# EAGLE design Bikota (EAGLE 9.5.2)
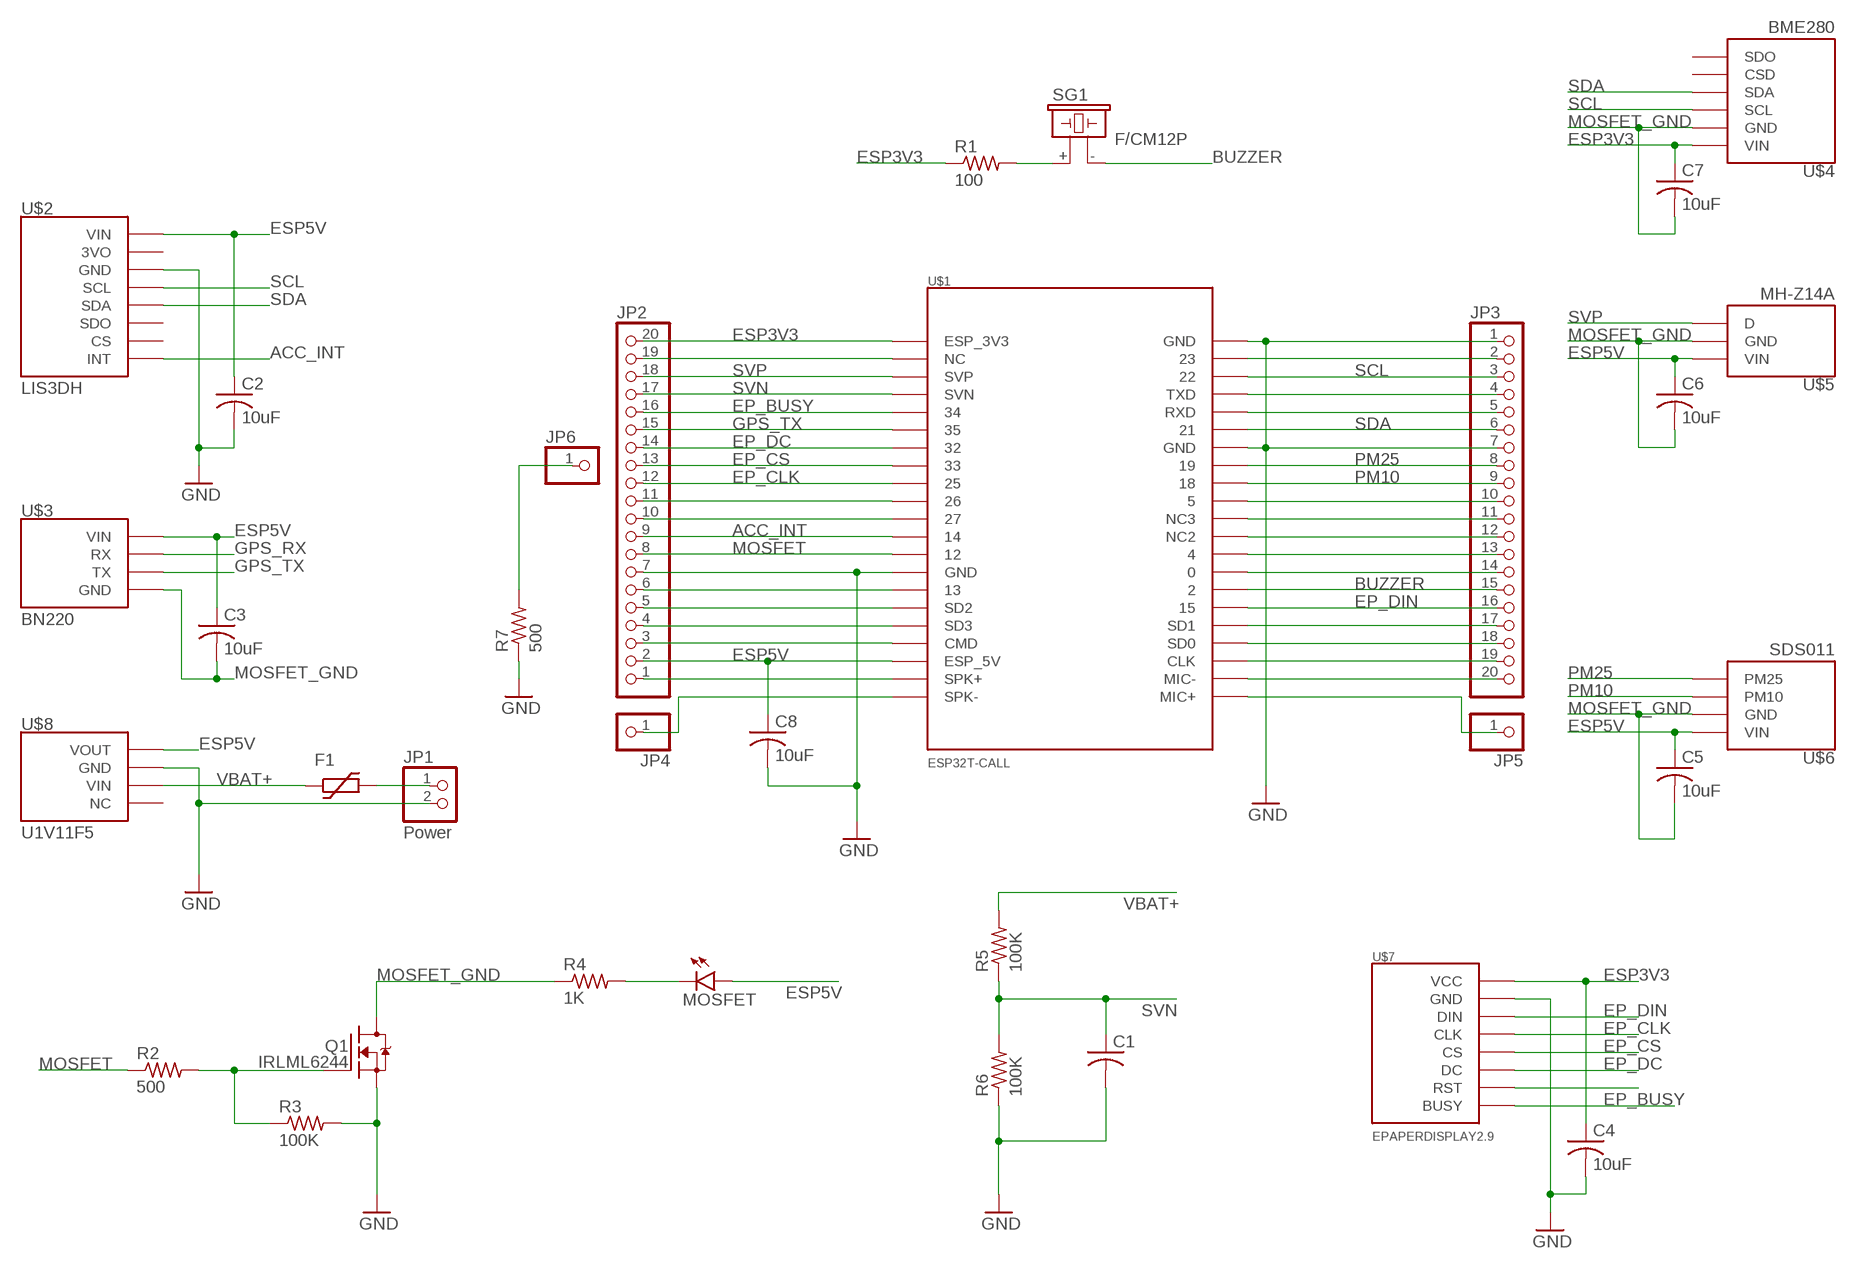
[diagram p0: schematic, sheet 1]

## Parts
C1  C-USC0805  [C0805]
C2  10uF  C-USC0805  [C0805]
C3  10uF  C-USC0805  [C0805]
C4  10uF  C-USC0805  [C0805]
C5  10uF  C-USC0805  [C0805]
C6  10uF  C-USC0805  [C0805]
C7  10uF  C-USC0805  [C0805]
C8  10uF  C-USC0805  [C0805]
F1  1206L  [1206L]
JP1  Power  PINHD-1X2  [1X02]
JP2  PINHD-1X20  [1X20]
JP3  PINHD-1X20  [1X20]
JP4  PINHD-1X1  [1X01]
JP5  PINHD-1X1  [1X01]
JP6  PINHD-1X1  [1X01]
MOSFET  LEDCHIPLED_0805  [CHIPLED_0805]
Q1  IRLML6244  [SOT23]
R1  100  R-US_R0805  [R0805]
R2  500  R-US_R0805  [R0805]
R3  100K  R-US_R0805  [R0805]
R4  1K  R-US_R0805  [R0805]
R5  100K  R-US_R0805  [R0805]
R6  100K  R-US_R0805  [R0805]
R7  500  R-US_R0805  [R0805]
SG1  F/CM12P  [F/CM12P]
U$1  ESP32T-CALL  [ESP32T-CALL]
U$2  LIS3DH  [LIS3DH]
U$3  BN220  [BN220]
U$4  BME280  [BME280]
U$5  MH-Z14A  [MH-Z14A]
U$6  SDS011  [SDS011]
U$7  EPAPERDISPLAY2.9  [EPAPERDISPLAY2.9]
U$8  U1V11F5  [U1V11F5]

## Nets
ACC_INT: JP2.9 U$1.GPIO14 U$2.P$8(INT)
BUZZER: JP3.15 SG1.- U$1.GPIO2
EP_BUSY: JP2.16 U$1.GPIO34 U$7.P$8(BUSY)
EP_CLK: JP2.12 U$1.GPIO25 U$7.P$4(CLK)
EP_CS: JP2.13 U$1.GPIO33 U$7.P$5(CS)
EP_DC: JP2.14 U$1.GPIO32 U$7.P$6(DC)
EP_DIN: JP3.16 U$1.GPIO15 U$7.P$3(DIN)
ESP3V3: C4.1 C7.1 JP2.20 R1.1 U$1.ESP32_3V3(ESP_3V3) U$4.P$1(VIN) U$7.P$1(VCC)
ESP5V: C2.1 C3.1 C5.1 C6.1 C8.1 JP2.2 MOSFET.A U$1.ESP32_5V(ESP_5V) U$2.P$1(VIN) U$3.P$1(VIN) U$5.P$1(VIN) U$6.P$1(VIN) U$8.P$1(VOUT)
GND: C1.2 C2.2 C4.2 C8.2 JP1.2 JP2.7 JP3.1 JP3.7 Q1.2(S) R3.2 R6.1 R7.1 U$1.GND U$1.GND2(GND) U$1.GND3(GND) U$2.P$3(GND) U$7.P$2(GND) U$8.P$2(GND)
GPS_RX: U$3.P$2(RX)
GPS_TX: JP2.15 U$1.GPIO35 U$3.P$3(TX)
MOSFET: JP2.8 R2.1 U$1.GPIO12
MOSFET_GND: C3.2 C5.2 C6.2 C7.2 Q1.3(D) R4.1 U$3.P$4(GND) U$4.P$2(GND) U$5.P$2(GND) U$6.P$2(GND)
N$2: R1.2 SG1.+
N$3: JP2.19 U$1.P$2(NC)
N$4: Q1.1(G) R2.2 R3.1
N$6: MOSFET.C R4.2
N$9: JP2.11 U$1.GPIO26
N$10: JP2.10 U$1.GPIO27
N$11: JP2.6 U$1.GPIO13
N$12: JP2.5 U$1.SD2
N$13: JP2.4 U$1.SD3
N$14: JP2.3 U$1.CMD
N$15: JP2.1 U$1.SPK+
N$16: JP4.1 U$1.SPK-
N$17: JP6.1 R7.2
N$18: JP3.2 U$1.GPIO23
N$20: JP3.4 U$1.TXD
N$21: JP3.5 U$1.RXD
N$23: JP3.10 U$1.GPIO5
N$24: JP3.11 U$1.NC3
N$25: JP3.12 U$1.NC2
N$26: JP3.13 U$1.GPIO4
N$27: JP3.14 U$1.GPIO0
N$29: JP3.17 U$1.SD1
N$30: JP3.18 U$1.SD0
N$31: JP3.19 U$1.CLK
N$32: JP3.20 U$1.MIC-
N$33: JP5.1 U$1.MIC+
N$41: F1.P$2 JP1.1
N$418: U$7.P$7(RST)
PM10: JP3.9 U$1.GPIO18 U$6.P$3(PM10)
PM25: JP3.8 U$1.GPIO19 U$6.P$4(PM25)
SCL: JP3.3 U$1.GPIO22 U$2.P$4(SCL) U$4.P$3(SCL)
SDA: JP3.6 U$1.GPIO21 U$2.P$5(SDA) U$4.P$4(SDA)
SVN: C1.1 JP2.17 R5.1 R6.2 U$1.SVN
SVP: JP2.18 U$1.SVP U$5.P$3(D)
VBAT+: F1.P$1 R5.2 U$8.P$3(VIN)
Unconnected: U$2.P$6(SDO) U$2.P$7(CS) U$4.P$5(CSD) U$4.P$6(SDO) U$8.P$4(NC)

## Power pins joined to a net without a drawn wire
3VO: U$2.P$2(3VO)

## Library data of the parts
C1-C8 = rcl:C-US: CAPACITOR, American symbol; SPICEPREFIX: C
F1 = ptc-littlefuse:1206L
JP1 = pinhead:PINHD-1X2: PIN HEADER
JP2 JP3 = pinhead:PINHD-1X20: PIN HEADER
JP4-JP6 = pinhead:PINHD-1X1: PIN HEADER
MOSFET = led:LED: LED OSRAM: - CHIPLED LG R971, LG N971, LY N971, LG Q971, LY Q971, LO R971, LY R971 LH N974, LH R974 LS Q976, LO Q976, LY Q976 LO Q996 - Hyper CHIPLED LW Q18S LB Q993, LB Q99A, LB R99A - SideLED LS A670, LO A670, LY A670, LG A670, LP A670 LB A673, LV A673, LT A673, LW A673 LH A674 LY A675 LS A676, LA A676, LO A676, LY A676, LW A676 LS A679, LY A679, LG A679 - Hyper Micro SIDELED® LS Y876, LA Y876, LO Y876, LY Y876 LT Y87S - SmartLED LW L88C, LW L88S LB L89C, LB L89S, LG L890 LS L89K, LO L89K, LY L89K LS L896, LA L896, LO L896, LY L896 - TOPLED LS T670, LO T670, LY T670, LG T670, LP T670 LSG T670, LSP T670, LSY T670, LOP T670, LYG T670 LG T671, LOG T671, LSG T671 LB T673, LV T673, LT T673, LW T673 LH T674 LS T676, LA T676, LO T676, LY T676, LB T676, LH T676, LSB T676, LW T676 LB T67C, LV T67C, LT T67C, LS T67K, LO T67K, LY T67K, LW E67C LS E67B, LA E67B, LO E67B, LY E67B, LB E67C, LV E67C, LT E67C LW T67C LS T679, LY T679, LG T679 LS T770, LO T770, LY T770, LG T770, LP T770 LB T773, LV T773, LT T773, LW T773 LH T774 LS E675, LA E675, LY E675, LS T675 LS T776, LA T776, LO T776, LY T776, LB T776 LHGB T686 LT T68C, LB T68C - Hyper Mini TOPLED® LB M676 - Mini TOPLED Santana® LG M470 LS M47K, LO M47K, LY M47K Source: http://www.osram.convergy.de LUXEON: - LUMILED® LXK2-PW12-R00, LXK2-PW12-S00, LXK2-PW14-U00, LXK2-PW14-V00 LXK2-PM12-R00, LXK2-PM12-S00, LXK2-PM14-U00 LXK2-PE12-Q00, LXK2-PE12-R00, LXK2-PE12-S00, LXK2-PE14-T00, LXK2-PE14-U00 LXK2-PB12-K00, LXK2-PB12-L00, LXK2-PB12-M00, LXK2-PB14-N00, LXK2-PB14-P00, LXK2-PB14-Q00 LXK2-PR12-L00, LXK2-PR12-M00, LXK2-PR14-Q00, LXK2-PR14-R00 LXK2-PD12-Q00, LXK2-PD12-R00, LXK2-PD12-S00 LXK2-PH12-R00, LXK2-PH12-S00 LXK2-PL12-P00, LXK2-PL12-Q00, LXK2-PL12-R00 Source: www.luxeon.com KINGBRIGHT: KA-3528ASYC Source: www.kingbright.com
Q1 = bytewerk:IRLML6244: n-channel FET Vds=20V Vgs=+-12V Icont=6A; MF: Internat. Rectifier; MPN: IRLML6244TRPbF; OC_FARNELL: 1864517RL
R1-R7 = rcl:R-US_: RESISTOR, American symbol; SPICEPREFIX: R
SG1 = buzzer:F/CM12P: BUZZER Source: Buerklin; OC_FARNELL: unknown; OC_NEWARK: unknown
U$1 = Bikota:ESP32T-CALL
U$2 = Bikota:LIS3DH
U$3 = Bikota:BN220
U$4 = Bikota:BME280
U$5 = Bikota:MH-Z14A
U$6 = Bikota:SDS011
U$7 = Bikota:EPAPERDISPLAY2.9
U$8 = Bikota:U1V11F5

## Board
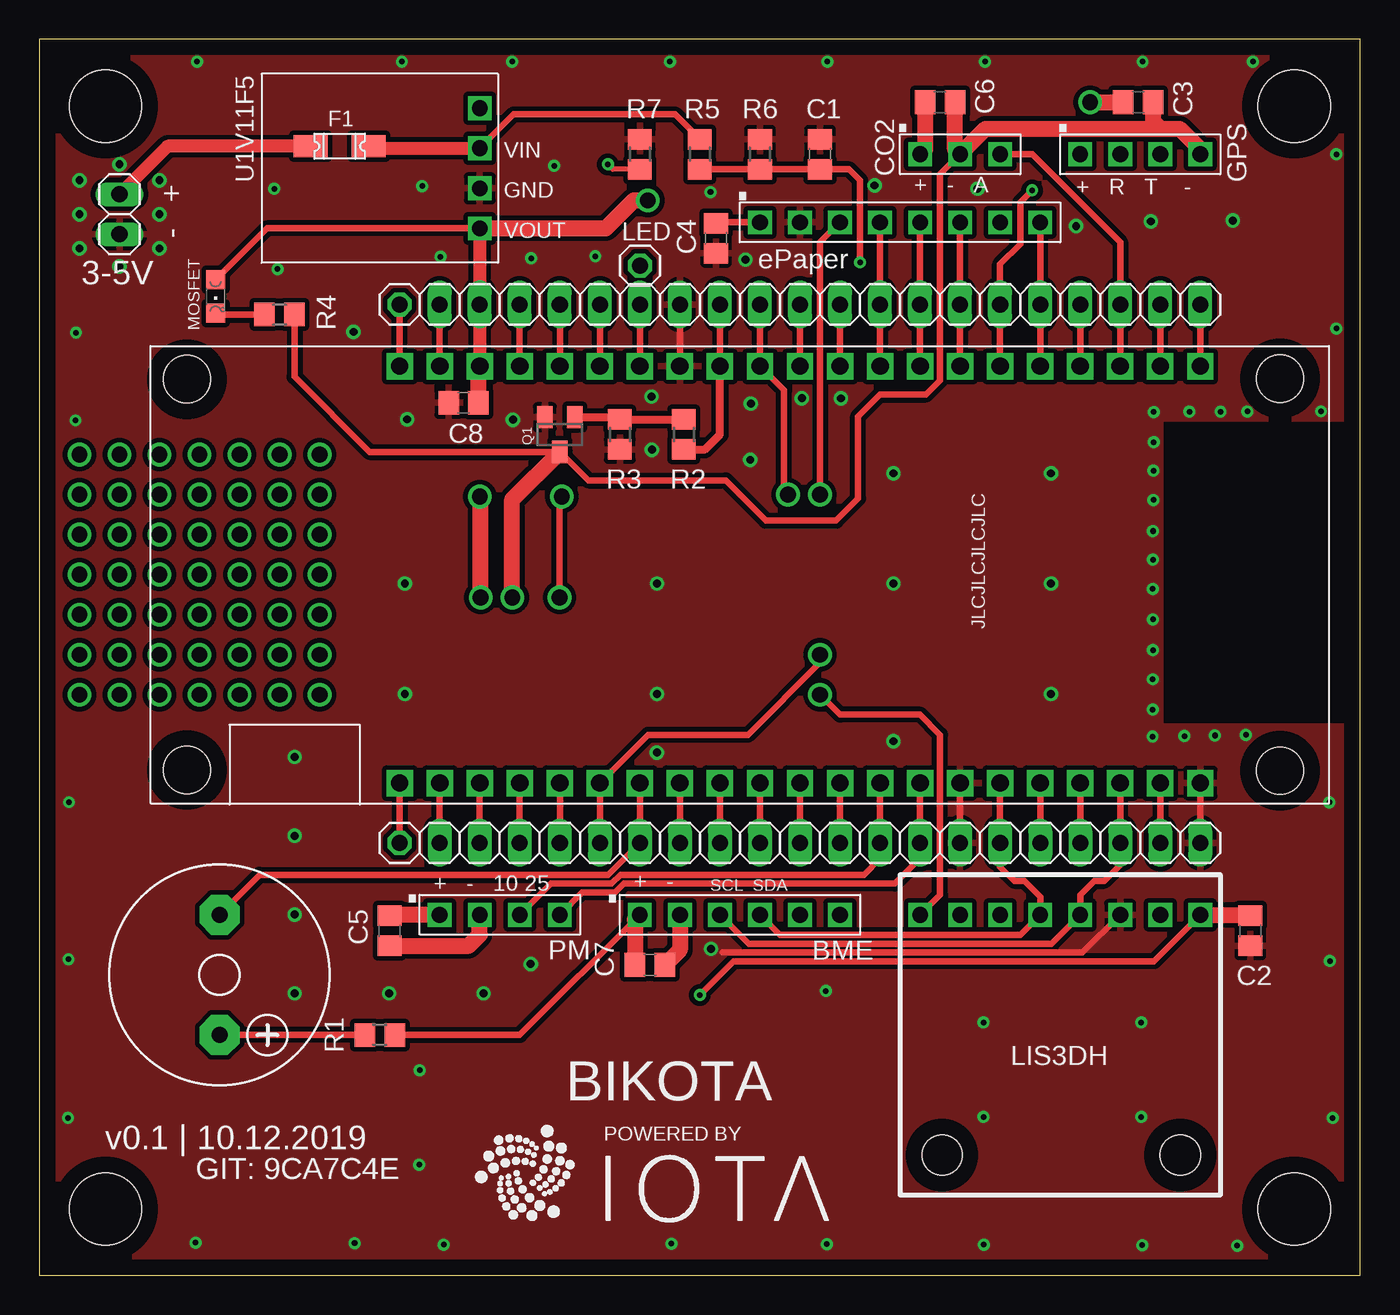
[diagram p1: board, top side]
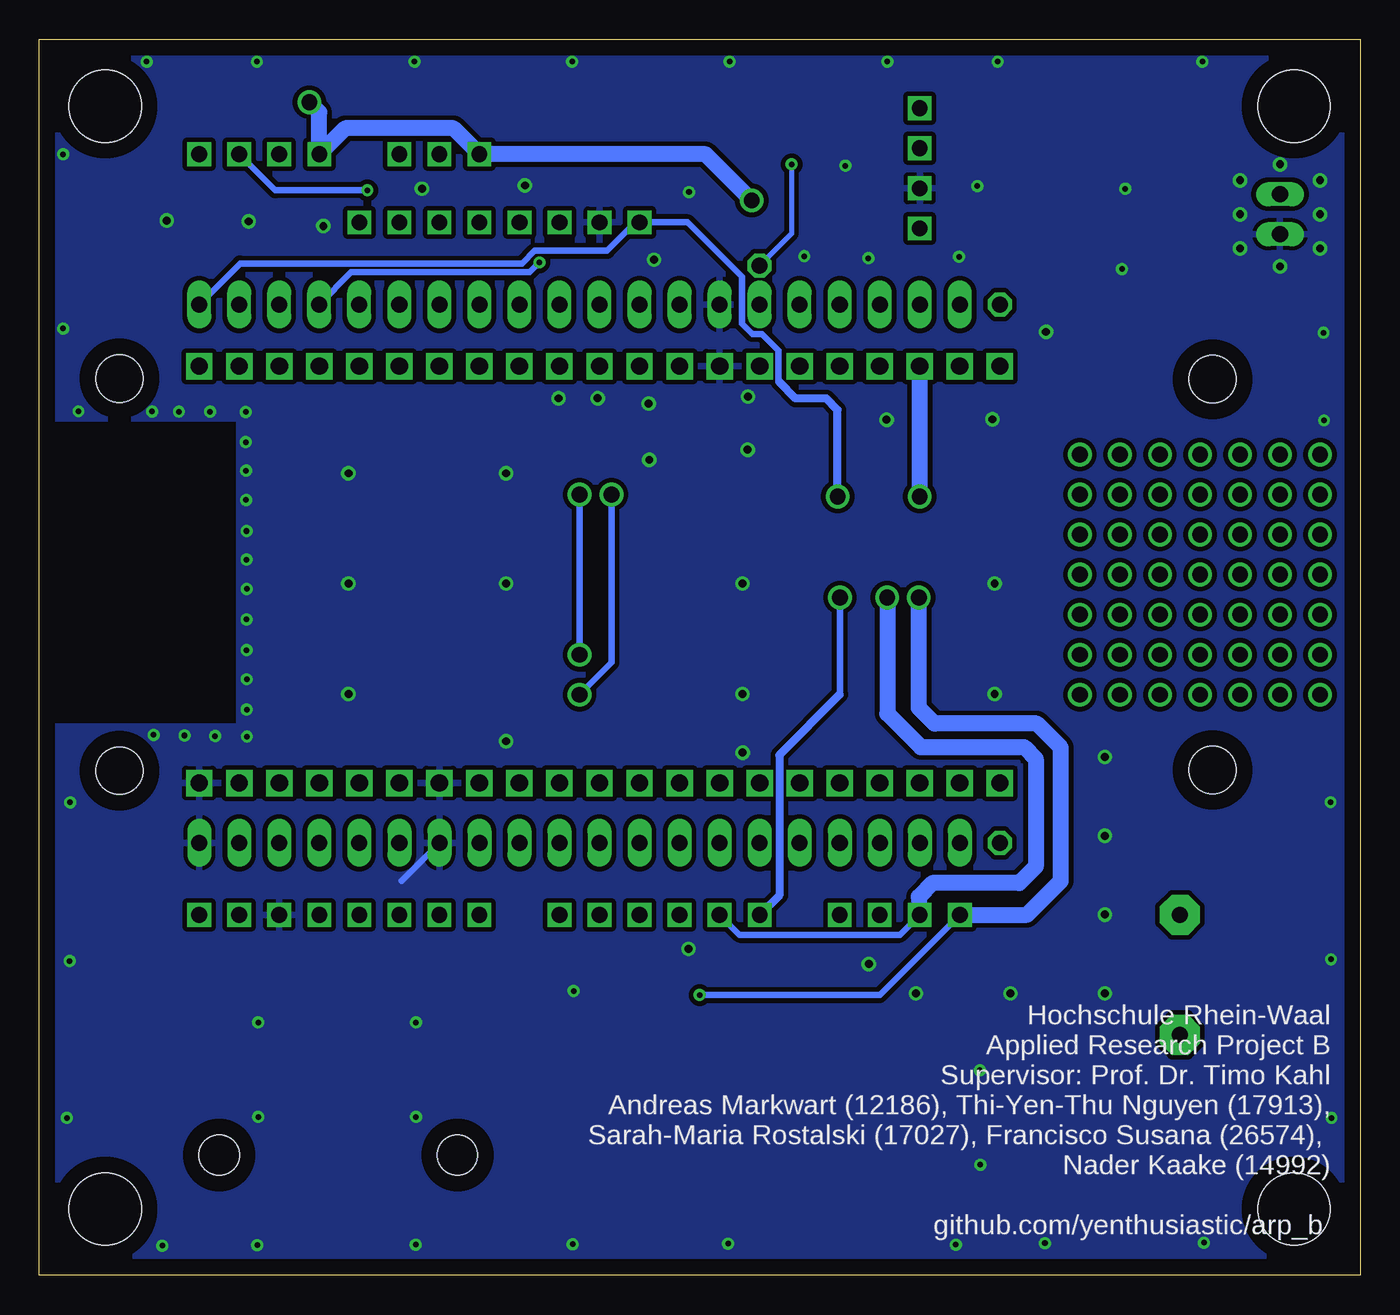
[diagram p2: board, bottom side, seen from below]

Size 83.8 x 78.41 mm. Coordinates in mm from the lower left corner, seen from the top.
Outline: 0,0 83.8,0 83.8,78.41 0,78.41 0,0
Copper layers (1*16): Top 0.035mm / dielectric 1.5mm / Bottom 0.035mm
Design rules "default": minimum track width 6mil, minimum drill 0.35mm, track to track 6mil, track to pad 6mil, pad to pad 6mil, via to via 6mil, smd to smd 6mil, copper to edge 40mil, drill to drill 6mil, minimum pad ring 10mil, minimum via ring 8mil, stop-mask expansion 4mil, vias tented up to drill 0mil, thermal gap 10mil
Holes 4.57 mm at 4.19,74.17 79.63,74.17 4.19,4.19 79.63,4.19

### Footprints (pad centres in the part's own frame; a part is rotated, then mirrored left to right if it is on the bottom)
C0805 = smd 1.3 x 1.5: 1 -0.95,0; 2 0.95,0
1206L = smd 2.16 x 1.4: P$1 -1.85,0; P$2 1.85,0
1X02 = drill 1.016 long: 1 -1.27,0; 2 1.27,0
1X20 = drill 1.016 long: 1 -24.13,0; 2 -21.59,0; 3 -19.05,0; 4 -16.51,0; 5 -13.97,0; 6 -11.43,0; 7 -8.89,0; 8 -6.35,0; 9 -3.81,0; 10 -1.27,0; 11 1.27,0; 12 3.81,0; 13 6.35,0; 14 8.89,0; 15 11.43,0; 16 13.97,0; 17 16.51,0; 18 19.05,0; 19 21.59,0; 20 24.13,0
1X01 = drill 1.016 octagon: 1 0,0
CHIPLED_0805 = smd 1.2 x 1.2: A 0,-1.05; C 0,1.05
SOT23 = smd 1 x 1.4: 1 -0.95,-1.1; 2 0.95,-1.1; 3 0,1.1
R0805 = smd 1.3 x 1.5: 1 -0.95,0; 2 0.95,0
F/CM12P = drill 1.016 pad 2.54 octagon: + 3.81,0; - -3.81,0
ESP32T-CALL = drill 1.1 pad 1.676 square: CLK -16.51,-13.225; CMD -13.97,13.225; ESP32_3V3 29.21,13.225; ESP32_5V -16.51,13.225; GND -3.81,13.225; GND2 13.97,-13.225; GND3 29.21,-13.225; GPIO0 -3.81,-13.225; GPIO2 -6.35,-13.225; GPIO4 -1.27,-13.225; GPIO5 6.35,-13.225; GPIO12 -1.27,13.225; GPIO13 -6.35,13.225; GPIO14 1.27,13.225; GPIO15 -8.89,-13.225; GPIO18 8.89,-13.225; GPIO19 11.43,-13.225; GPIO21 16.51,-13.225; GPIO22 24.13,-13.225; GPIO23 26.67,-13.225; GPIO25 8.89,13.225; GPIO26 6.35,13.225; GPIO27 3.81,13.225; GPIO32 13.97,13.225; GPIO33 11.43,13.225; GPIO34 19.05,13.225; GPIO35 16.51,13.225; MIC+ -21.59,-13.225; MIC- -19.05,-13.225; NC2 1.27,-13.225; NC3 3.81,-13.225; P$2 26.67,13.225; RXD 19.05,-13.225; SD0 -13.97,-13.225; SD1 -11.43,-13.225; SD2 -8.89,13.225; SD3 -11.43,13.225; SPK+ -19.05,13.225; SPK- -21.59,13.225; SVN 21.59,13.225; SVP 24.13,13.225; TXD 21.59,-13.225 | hole 3: 34.27,12.445; 34.27,-12.445; -35.09,12.395; -35.09,-12.395
LIS3DH = drill 1 square: P$1 -8.89,-8.89; P$2 -6.35,-8.89; P$3 -3.81,-8.89; P$4 -1.27,-8.89; P$5 1.27,-8.89; P$6 3.81,-8.89; P$7 6.35,-8.89; P$8 8.89,-8.89 | hole 2.54: -7.62,6.35; 7.493,6.35
BN220 = drill 1 square: P$1 0,3.81; P$2 0,1.27; P$3 0,-1.27; P$4 0,-3.81
BME280 = drill 1 square: P$1 0,6.35; P$2 0,3.81; P$3 0,1.27; P$4 0,-1.27; P$5 0,-3.81; P$6 0,-6.35
MH-Z14A = drill 1 square: P$1 0,2.54; P$2 0,0; P$3 0,-2.54
SDS011 = drill 1 square: P$1 0,3.81; P$2 0,1.27; P$3 0,-1.27; P$4 0,-3.81
EPAPERDISPLAY2.9 = drill 1 square: P$1 0,8.89; P$2 0,6.35; P$3 0,3.81; P$4 0,1.27; P$5 0,-1.27; P$6 0,-3.81; P$7 0,-6.35; P$8 0,-8.89
U1V11F5 = drill 1 square: P$1 -6.35,3.81; P$2 -6.35,1.27; P$3 -6.35,-1.27; P$4 -6.35,-3.81

### Placement (x,y rotation side)
C1  49.53,71.12 90 top
C2  76.83,21.84 270 top
C3  69.72,74.42 0 top
C4  42.93,65.79 270 top
C5  22.23,21.84 270 top
C6  57.15,74.42 0 top
C7  38.73,19.68 0 top
C8  26.91,55.35 180 top
F1  19.05,71.63 180 top
JP1  5.08,67.31 270 top
JP2  49.53,61.59 0 top
JP3  49.53,27.43 180 top
JP4  22.86,61.59 0 top
JP5  22.86,27.43 0 top
JP6  38.1,64.04 90 top
MOSFET  11.18,62.1 180 top
Q1  33.02,53.34 180 top
R1  21.59,15.24 180 top
R2  40.89,53.34 90 top
R3  36.83,53.34 270 top
R4  15.24,60.96 180 top
R5  41.91,71.12 90 top
R6  45.72,71.12 270 top
R7  38.1,71.12 270 top
SG1  11.43,19.05 270 top
U$1  44.45,44.45 0 top
U$2  64.77,13.97 180 top
U$3  69.85,71.12 90 top
U$4  44.45,22.86 90 top
U$5  58.42,71.12 90 top
U$6  29.21,22.86 90 top
U$7  54.61,66.8 90 top
U$8  21.59,70.23 180 top

### Tracks (layer width: path | path; a pad name or v marks a point on that pad's centre or on a via)
ACC_INT  (via drill 1)
  Top 0.406: JP2.9 U$1.GPIO14 47.25,56.14 47.25,49.77 v47.5,49.53 | U$2.P$8 57.15,24.13 57.15,34.29 55.88,35.56 50.8,35.56 v49.53,36.83
  Bottom 0.406: v49.53,36.83 47.5,38.86 v47.5,49.53
BUZZER
  Top 0.406: U$1.GPIO2 JP3.15 36.07,25.4 13.97,25.4 SG1.-
EP_BUSY
  Top 0.406: U$1.GPIO34 JP2.16 U$7.P$8
EP_CLK
  Top 0.406: U$7.P$4 JP2.12 U$1.GPIO25
EP_CS
  Top 0.406: U$1.GPIO33 JP2.13 U$7.P$5
EP_DC
  Top 0.406: U$7.P$6 JP2.14 U$1.GPIO32
EP_DIN  (via drill 1)
  Top 0.406: JP3.16 U$1.GPIO15 38.62,34.29 44.96,34.29 49.53,38.86 v49.53,39.37 | U$7.P$3 49.53,65.53 v49.53,49.53
  Bottom 0.406: v49.53,49.53 v49.53,39.37
ESP3V3  (via drill 1)
  Top 0.406: JP2.20 U$1.ESP32_3V3 | R1.1 30.48,15.24 U$4.P$1 | C4.1 42.99,66.8 U$7.P$1 | v33,43 33,49.26 v33.15,49.4
  Top 1.016: U$4.P$1 37.78,22.55 C7.1
  Bottom 0.406: JP2.20 71.07,64.19 53.18,64.19 52.37,65 47.78,65 45.97,66.8 U$7.P$1 42.67,66.8 39.22,63.35 39.22,60.37 38.56,59.72 37.96,59.72 36.91,58.66 36.91,56.72 36.85,56.67 | 33.02,36.83 33,36.85 v33,43
  Bottom 0.508: v33.15,49.4 33.15,54.9 33.87,55.63 35.81,55.63 36.85,56.67 | 33.02,36.83 36.85,32.99 36.85,24.11 U$4.P$1
ESP5V  (via drill 0.35, 1)
  Top 0.406: v41.91,17.78 44.04,19.91 70.71,19.91 U$2.P$1 | MOSFET.A 14.44,66.42 U$8.P$1
  Top 0.813: U$8.P$1 JP2.2 U$1.ESP32_5V
  Top 1.016: U$8.P$1 35.94,66.42 37.72,68.2 v38.61,68.2 | U$2.P$1 76.77,22.86 C2.1 | C6.1 56.2,71.44 U$5.P$1 | v66.67,74.42 C3.1 | U$6.P$1 22.29,22.86 C5.1 | v28,43 28,49.34 v27.94,49.4 | U$1.ESP32_5V 27.86,57.6 C8.1
  Bottom 0.406: v41.91,17.78 30.48,17.78 U$6.P$1
  Bottom 1.016: v66.67,74.42 66.04,73.79 U$3.P$1 64.39,72.77 57.53,72.77 U$5.P$1 41.53,71.12 v38.61,68.2 | U$6.P$1 21.14,22.86 19,25 19,33.48 20.52,35 27,35 28,36 v28,43 | v27.94,49.4 U$1.ESP32_5V
GND  (via drill 0.35, 0.5)
  Top 0.406: U$1.GND3 JP3.1 73.66,26.67 | JP3.7 U$1.GND2 | U$2.P$3 66.19,20.47 43.33,20.47 | U$1.GND JP2.7
  Bottom 0.406: 60.83,25.02 JP3.7
  other vias: 10,77 23,77 30,77 40,77 50,77 60,77 70,77 77,77 82.3,71.12 82.3,60.07 81.32,54.81 76.65,54.8 74.94,54.79 72.97,54.78 70.71,54.77 70.7,52.86 70.69,51.04 70.69,49.19 70.66,47.21 70.66,45.39 70.65,43.54 70.66,41.61 70.66,39.66 70.65,37.81 70.64,35.88 70.63,34.17 72.66,34.21 74.59,34.24 76.55,34.28 81.85,30 81.89,19.93 82.06,9.97 76,1.87 69.98,1.91 59.92,1.94 49.96,1.97 40.09,2 20,2.03 9.91,2.06 1.81,9.97 1.84,20.04 1.88,30.01 2.29,54.24 2.32,59.8 2.54,69.47 2.54,67.31 2.54,65.15 5.08,70.48 7.62,69.47 7.62,67.31 7.62,65.15 5.08,64.01 15.11,63.84 19.93,59.85 25.45,64.62 31.2,64.52 35.27,64.65 32.66,70.39 24.29,69.1 14.9,68.93 38.86,52.37 42.58,68.72 59.53,68.93 52.99,69.15 65.78,66.57 70.52,66.86 75.72,66.92 44.8,64.43 45.14,55.3 45.1,51.73 38.84,55.74 23.33,54.3 23.19,43.88 23.19,36.88 39.19,36.88 39.19,43.88 54.19,43.88 64.19,43.88 64.19,50.88 54.19,50.88 64.19,36.88 16.19,32.88 16.19,27.88 16.19,22.88 16.19,17.88 22.19,17.88 28.19,17.88 31.18,19.74 42.61,20.7 49.91,18.03 59.91,16.03 59.91,10.03 69.91,10.03 69.91,16.03 54.19,33.88 39.18,33.15 50.86,55.63 48.38,55.64 24.13,13 24.09,7 25.66,1.94 30.05,54.28
  pour Top (isolate 0.305): 0.25,0.13 0.25,78.11 83.57,78.11 83.57,54.36 71.12,54.36 71.12,34.8 83.57,34.8 83.57,0.13
  pour Bottom (isolate 0.305): 0,0 83.57,0 83.57,34.8 71.12,34.8 71.12,54.36 83.69,54.36 83.69,78.11 0,78.11
GPS_TX  (via drill 0.35)
  Top 0.406: U$1.GPIO35 JP2.15 60.96,64.14 62.23,65.41 62.23,68.07 v62.99,68.83
  Bottom 0.406: v62.99,68.83 68.83,68.83 U$3.P$3
MOSFET
  Top 0.406: JP2.8 U$1.GPIO12
  Top 0.508: R2.1 42.23,52.39 43.18,53.34 U$1.GPIO12
MOSFET_GND  (via drill 1)
  Top 0.406: U$5.P$2 57.15,69.85 57.15,56.77 56.26,55.88 53.34,55.88 51.94,54.48 51.94,49.28 50.55,47.88 46.1,47.88 43.56,50.42 34.84,50.42 Q1.3 20.95,52.24 16.19,57 R4.1
  Top 1.016: U$6.P$2 27.94,21.59 27.24,20.89 C5.2 | C6.2 58.1,71.44 U$5.P$2 60.04,72.74 71.12,72.74 | U$3.P$4 73.66,71.44 72.36,72.74 71.12,72.74 | 71.12,72.74 70.67,73.19 C3.2 | U$4.P$2 40.64,20.64 C7.2 | v30,43 30,49.22 Q1.3
  Bottom 0.406: U$4.P$2 39.37,21.59 29.21,21.59 U$6.P$2
  Bottom 1.016: v30,43 30,35.63 27.87,33.51 21.32,33.51 20.57,32.77 20.57,25.92 21.62,24.87 27.13,24.87 28,24 28,22.92 U$6.P$2
N$1  (via drill 1)
  other vias: 15.24,52.07
N$2
  Top 0.406: R1.2 SG1.+
N$3
  Top 0.406: U$1.P$2 JP2.19
N$4
  Top 0.508: R2.2 R3.1 36.68,54.44 Q1.1
N$5  (via drill 1)
  other vias: 17.78,52.07
N$6
  Top 0.406: MOSFET.C 11.27,60.96 R4.2
N$7  (via drill 1)
  other vias: 15.24,49.53
N$8  (via drill 1)
  other vias: 17.78,49.53
N$9
  Top 0.406: JP2.11 U$1.GPIO26
N$10
  Top 0.406: JP2.10 U$1.GPIO27
N$11
  Top 0.406: JP2.6 U$1.GPIO13
N$12
  Top 0.406: U$1.SD2 JP2.5
N$13
  Top 0.406: JP2.4 U$1.SD3
N$14
  Top 0.406: U$1.CMD JP2.3
N$15
  Top 0.406: JP2.1 U$1.SPK+
N$16
  Top 0.406: U$1.SPK- JP4.1
N$17  (via drill 0.35)
  Top 0.305: R7.2 36.38,70.17 v36.07,70.48
  Bottom 0.305: v36.07,70.48 36.07,66.07 JP6.1
N$18
  Top 0.406: U$1.GPIO23 JP3.2
N$19  (via drill 1)
  other vias: 15.24,46.99
N$20
  Top 0.406: U$1.TXD JP3.4
N$21
  Top 0.406: JP3.5 U$1.RXD
N$22  (via drill 1)
  other vias: 17.78,46.99
N$23
  Top 0.406: U$1.GPIO5 JP3.10
N$24
  Top 0.406: JP3.11 U$1.NC3
N$25
  Top 0.406: U$1.NC2 JP3.12
N$26
  Top 0.406: JP3.13 U$1.GPIO4
N$27
  Top 0.406: JP3.14 U$1.GPIO0
N$28  (via drill 1)
  other vias: 15.24,44.45
N$29
  Top 0.406: JP3.17 U$1.SD1
N$30
  Top 0.406: U$1.SD0 JP3.18
N$31
  Top 0.406: U$1.CLK JP3.19
N$32
  Top 0.406: JP3.20 U$1.MIC-
N$33
  Top 0.406: U$1.MIC+ JP5.1
N$34  (via drill 1)
  other vias: 17.78,44.45
N$35  (via drill 1)
  other vias: 15.24,41.91
N$36  (via drill 1)
  other vias: 17.78,41.91
N$37  (via drill 1)
  other vias: 15.24,39.37
N$38  (via drill 1)
  other vias: 17.78,39.37
N$39  (via drill 1)
  other vias: 15.24,36.83
N$40  (via drill 1)
  other vias: 17.78,36.83
N$41
  Top 0.813: F1.P$2 8.13,71.63 JP1.1
N$197  (via drill 1)
  other vias: 7.62,52.07
N$198  (via drill 1)
  other vias: 10.16,52.07
N$199  (via drill 1)
  other vias: 12.7,52.07
N$200  (via drill 1)
  other vias: 2.54,52.07
N$201  (via drill 1)
  other vias: 5.08,52.07
N$207  (via drill 1)
  other vias: 7.62,49.53
N$208  (via drill 1)
  other vias: 10.16,49.53
N$209  (via drill 1)
  other vias: 12.7,49.53
N$210  (via drill 1)
  other vias: 2.54,49.53
N$211  (via drill 1)
  other vias: 5.08,49.53
N$217  (via drill 1)
  other vias: 7.62,46.99
N$218  (via drill 1)
  other vias: 10.16,46.99
N$219  (via drill 1)
  other vias: 12.7,46.99
N$220  (via drill 1)
  other vias: 2.54,46.99
N$221  (via drill 1)
  other vias: 5.08,46.99
N$227  (via drill 1)
  other vias: 7.62,44.45
N$228  (via drill 1)
  other vias: 10.16,44.45
N$229  (via drill 1)
  other vias: 12.7,44.45
N$230  (via drill 1)
  other vias: 2.54,44.45
N$231  (via drill 1)
  other vias: 5.08,44.45
N$237  (via drill 1)
  other vias: 7.62,41.91
N$238  (via drill 1)
  other vias: 10.16,41.91
N$239  (via drill 1)
  other vias: 12.7,41.91
N$240  (via drill 1)
  other vias: 2.54,41.91
N$241  (via drill 1)
  other vias: 5.08,41.91
N$247  (via drill 1)
  other vias: 7.62,39.37
N$248  (via drill 1)
  other vias: 10.16,39.37
N$249  (via drill 1)
  other vias: 12.7,39.37
N$250  (via drill 1)
  other vias: 2.54,39.37
N$251  (via drill 1)
  other vias: 5.08,39.37
N$257  (via drill 1)
  other vias: 7.62,36.83
N$258  (via drill 1)
  other vias: 10.16,36.83
N$259  (via drill 1)
  other vias: 12.7,36.83
N$260  (via drill 1)
  other vias: 2.54,36.83
N$261  (via drill 1)
  other vias: 5.08,36.83
PM10
  Top 0.406: U$1.GPIO18 JP3.9 53.34,26.43 52.31,25.4 36.86,25.4 36.3,24.84 32.46,24.84 U$6.P$3
PM25
  Top 0.406: U$1.GPIO19 JP3.8 55.88,26.43 54.29,24.84 37.09,24.84 36.53,24.28 34.44,24.28 U$6.P$4
SCL
  Top 0.406: U$1.GPIO22 JP3.3 68.58,26.04 67.56,25.02 66.93,25.02 66.04,24.13 U$2.P$4 64.21,21.03 45.01,21.03 U$4.P$3
SDA
  Top 0.406: U$1.GPIO21 JP3.6 60.96,25.91 61.85,25.02 62.48,25.02 63.5,24 U$2.P$5 62.23,21.59 46.99,21.59 U$4.P$4
SVN  (via drill 0.35)
  Top 0.406: JP2.17 U$1.SVN | v52.07,64.26 52.07,69.47 51.37,70.17 C1.1 R6.2 R5.1
  Bottom 0.406: JP2.17 64.01,63.63 52.7,63.63 v52.07,64.26
SVP
  Top 0.406: U$1.SVP JP2.18 68.58,65.53 62.99,71.12 U$5.P$3
VBAT+
  Top 0.406: U$8.P$3 30.1,73.66 40.32,73.66 R5.2
  Top 0.813: F1.P$1 21.03,71.5 U$8.P$3

### Text on the board
tNames: F1 | . | . | CO2 | - + | U1V11F5 | + - A | + R T - | GPS | . | VIN / / GND / / VOUT | LED | ePaper | 3-5V | JLCJLCJLCJLC | + - | . | + - 10 25 | . | SCL SDA | PM | BME | BIKOTA | POWERED BY | v0.1 | 10.12.2019 | GIT: 9CA7C4E
bNames: Hochschule Rhein-Waal / Applied Research Project B / Supervisor: Prof. Dr. Timo Kahl / Andreas Markwart (12186), Thi-Yen-Thu Nguyen (17913), / Sarah-Maria Rostalski (17027), Francisco Susana (26574), / Nader Kaake (14992) / / github.com/yenthusiastic/arp_b